# EAGLE design mycpu_monitor (EAGLE 6.5.0)
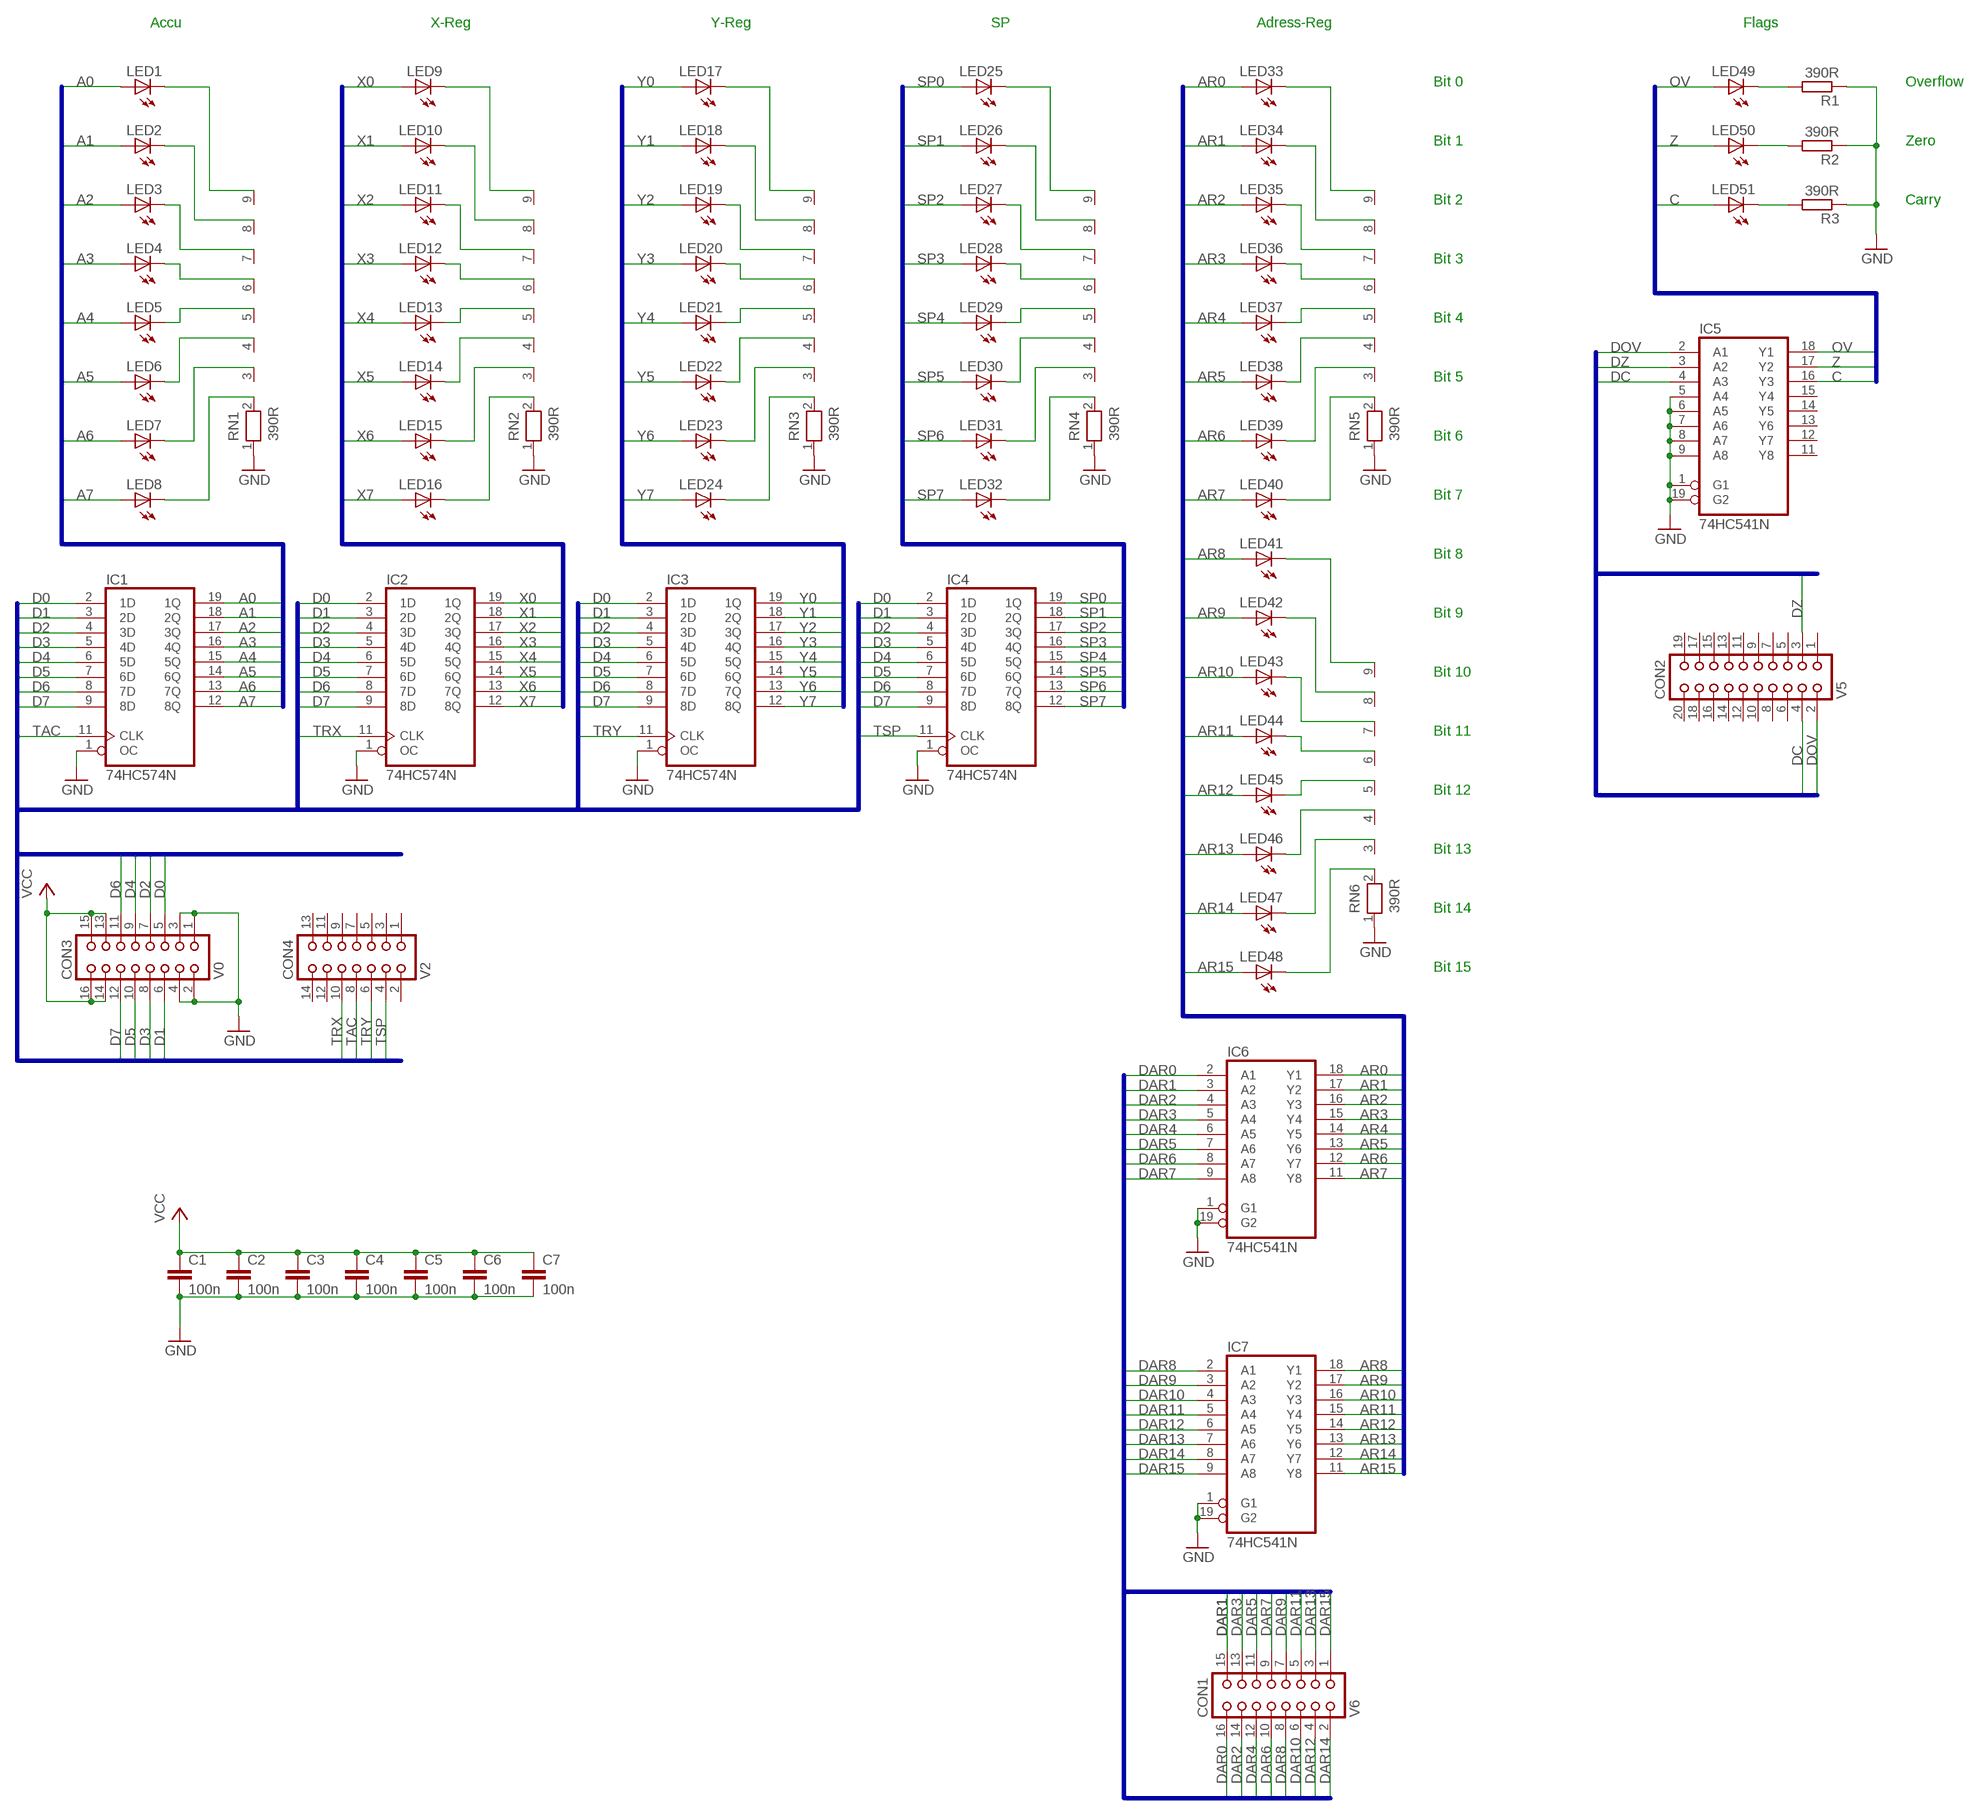
[diagram p0: schematic, sheet 1]

## Parts
C1  100n  C-EU050-024X044  [C050-024X044]
C2  100n  C-EU050-024X044  [C050-024X044]
C3  100n  C-EU050-024X044  [C050-024X044]
C4  100n  C-EU050-024X044  [C050-024X044]
C5  100n  C-EU050-024X044  [C050-024X044]
C6  100n  C-EU050-024X044  [C050-024X044]
C7  100n  C-EU050-024X044  [C050-024X044]
CON1  V6  CON16L  [CON16L]
CON2  V5  CON20L  [CON20L]
CON3  V0  CON16L  [CON16L]
CON4  V2  CON14L  [CON14L]
IC1  74HC574N  [DIL20]
IC2  74HC574N  [DIL20]
IC3  74HC574N  [DIL20]
IC4  74HC574N  [DIL20]
IC5  74HC541N  [DIL20]
IC6  74HC541N  [DIL20]
IC7  74HC541N  [DIL20]
LED1  LED3MM  [LED3MM]
LED2  LED3MM  [LED3MM]
LED3  LED3MM  [LED3MM]
LED4  LED3MM  [LED3MM]
LED5  LED3MM  [LED3MM]
LED6  LED3MM  [LED3MM]
LED7  LED3MM  [LED3MM]
LED8  LED3MM  [LED3MM]
LED9  LED3MM  [LED3MM]
LED10  LED3MM  [LED3MM]
LED11  LED3MM  [LED3MM]
LED12  LED3MM  [LED3MM]
LED13  LED3MM  [LED3MM]
LED14  LED3MM  [LED3MM]
LED15  LED3MM  [LED3MM]
LED16  LED3MM  [LED3MM]
LED17  LED3MM  [LED3MM]
LED18  LED3MM  [LED3MM]
LED19  LED3MM  [LED3MM]
LED20  LED3MM  [LED3MM]
LED21  LED3MM  [LED3MM]
LED22  LED3MM  [LED3MM]
LED23  LED3MM  [LED3MM]
LED24  LED3MM  [LED3MM]
LED25  LED3MM  [LED3MM]
LED26  LED3MM  [LED3MM]
LED27  LED3MM  [LED3MM]
LED28  LED3MM  [LED3MM]
LED29  LED3MM  [LED3MM]
LED30  LED3MM  [LED3MM]
LED31  LED3MM  [LED3MM]
LED32  LED3MM  [LED3MM]
LED33  LED3MM  [LED3MM]
LED34  LED3MM  [LED3MM]
LED35  LED3MM  [LED3MM]
LED36  LED3MM  [LED3MM]
LED37  LED3MM  [LED3MM]
LED38  LED3MM  [LED3MM]
LED39  LED3MM  [LED3MM]
LED40  LED3MM  [LED3MM]
LED41  LED3MM  [LED3MM]
LED42  LED3MM  [LED3MM]
LED43  LED3MM  [LED3MM]
LED44  LED3MM  [LED3MM]
LED45  LED3MM  [LED3MM]
LED46  LED3MM  [LED3MM]
LED47  LED3MM  [LED3MM]
LED48  LED3MM  [LED3MM]
LED49  LED3MM  [LED3MM]
LED50  LED3MM  [LED3MM]
LED51  LED3MM  [LED3MM]
R1  390R  R-EU_0207/7  [0207/7]
R2  390R  R-EU_0207/7  [0207/7]
R3  390R  R-EU_0207/7  [0207/7]
RN1  390R  RN08  [RN-9]
RN2  390R  RN08  [RN-9]
RN3  390R  RN08  [RN-9]
RN4  390R  RN08  [RN-9]
RN5  390R  RN08  [RN-9]
RN6  390R  RN08  [RN-9]

## Nets
A0: IC1.19(1Q) LED1.A
A1: IC1.18(2Q) LED2.A
A2: IC1.17(3Q) LED3.A
A3: IC1.16(4Q) LED4.A
A4: IC1.15(5Q) LED5.A
A5: IC1.14(6Q) LED6.A
A6: IC1.13(7Q) LED7.A
A7: IC1.12(8Q) LED8.A
AR0: IC6.18(Y1) LED33.A
AR1: IC6.17(Y2) LED34.A
AR2: IC6.16(Y3) LED35.A
AR3: IC6.15(Y4) LED36.A
AR4: IC6.14(Y5) LED37.A
AR5: IC6.13(Y6) LED38.A
AR6: IC6.12(Y7) LED39.A
AR7: IC6.11(Y8) LED40.A
AR8: IC7.18(Y1) LED41.A
AR9: IC7.17(Y2) LED42.A
AR10: IC7.16(Y3) LED43.A
AR11: IC7.15(Y4) LED44.A
AR12: IC7.14(Y5) LED45.A
AR13: IC7.13(Y6) LED46.A
AR14: IC7.12(Y7) LED47.A
AR15: IC7.11(Y8) LED48.A
C: IC5.16(Y3) LED51.A
D0: CON3.5 IC1.2(1D) IC2.2(1D) IC3.2(1D) IC4.2(1D)
D1: CON3.6 IC1.3(2D) IC2.3(2D) IC3.3(2D) IC4.3(2D)
D2: CON3.7 IC1.4(3D) IC2.4(3D) IC3.4(3D) IC4.4(3D)
D3: CON3.8 IC1.5(4D) IC2.5(4D) IC3.5(4D) IC4.5(4D)
D4: CON3.9 IC1.6(5D) IC2.6(5D) IC3.6(5D) IC4.6(5D)
D5: CON3.10 IC1.7(6D) IC2.7(6D) IC3.7(6D) IC4.7(6D)
D6: CON3.11 IC1.8(7D) IC2.8(7D) IC3.8(7D) IC4.8(7D)
D7: CON3.12 IC1.9(8D) IC2.9(8D) IC3.9(8D) IC4.9(8D)
DAR0: CON1.16 IC6.2(A1)
DAR1: CON1.15 IC6.3(A2)
DAR2: CON1.14 IC6.4(A3)
DAR3: CON1.13 IC6.5(A4)
DAR4: CON1.12 IC6.6(A5)
DAR5: CON1.11 IC6.7(A6)
DAR6: CON1.10 IC6.8(A7)
DAR7: CON1.9 IC6.9(A8)
DAR8: CON1.8 IC7.2(A1)
DAR9: CON1.7 IC7.3(A2)
DAR10: CON1.6 IC7.4(A3)
DAR11: CON1.5 IC7.5(A4)
DAR12: CON1.4 IC7.6(A5)
DAR13: CON1.3 IC7.7(A6)
DAR14: CON1.2 IC7.8(A7)
DAR15: CON1.1 IC7.9(A8)
DC: CON2.4 IC5.4(A3)
DOV: CON2.2 IC5.2(A1)
DZ: CON2.3 IC5.3(A2)
GND: C1.2 C2.2 C3.2 C4.2 C5.2 C6.2 C7.2 CON3.1 CON3.2 CON3.3 CON3.4 IC1.1(OC) IC2.1(OC) IC3.1(OC) IC4.1(OC) IC5.1(G1) IC5.5(A4) IC5.6(A5) IC5.7(A6) IC5.8(A7) IC5.9(A8) IC5.19(G2) IC6.1(G1) IC6.19(G2) IC7.1(G1) IC7.19(G2) R1.1 R2.1 R3.1 RN1.1 RN2.1 RN3.1 RN4.1 RN5.1 RN6.1
N$1: LED8.K(C) RN1.2
N$2: LED7.K(C) RN1.3
N$3: LED6.K(C) RN1.4
N$4: LED5.K(C) RN1.5
N$5: LED4.K(C) RN1.6
N$6: LED3.K(C) RN1.7
N$7: LED2.K(C) RN1.8
N$8: LED1.K(C) RN1.9
N$9: LED16.K(C) RN2.2
N$10: LED15.K(C) RN2.3
N$11: LED14.K(C) RN2.4
N$12: LED13.K(C) RN2.5
N$13: LED12.K(C) RN2.6
N$14: LED11.K(C) RN2.7
N$15: LED10.K(C) RN2.8
N$16: LED9.K(C) RN2.9
N$17: LED24.K(C) RN3.2
N$18: LED23.K(C) RN3.3
N$19: LED22.K(C) RN3.4
N$20: LED21.K(C) RN3.5
N$21: LED20.K(C) RN3.6
N$22: LED19.K(C) RN3.7
N$23: LED18.K(C) RN3.8
N$24: LED17.K(C) RN3.9
N$25: LED32.K(C) RN4.2
N$26: LED31.K(C) RN4.3
N$27: LED30.K(C) RN4.4
N$28: LED29.K(C) RN4.5
N$29: LED28.K(C) RN4.6
N$30: LED27.K(C) RN4.7
N$31: LED26.K(C) RN4.8
N$32: LED25.K(C) RN4.9
N$33: LED40.K(C) RN5.2
N$34: LED39.K(C) RN5.3
N$35: LED38.K(C) RN5.4
N$36: LED37.K(C) RN5.5
N$37: LED36.K(C) RN5.6
N$38: LED35.K(C) RN5.7
N$39: LED34.K(C) RN5.8
N$40: LED33.K(C) RN5.9
N$41: LED48.K(C) RN6.2
N$42: LED47.K(C) RN6.3
N$43: LED46.K(C) RN6.4
N$44: LED45.K(C) RN6.5
N$45: LED44.K(C) RN6.6
N$46: LED43.K(C) RN6.7
N$47: LED42.K(C) RN6.8
N$48: LED41.K(C) RN6.9
N$49: LED51.K(C) R3.2
N$50: LED50.K(C) R2.2
N$51: LED49.K(C) R1.2
OV: IC5.18(Y1) LED49.A
SP0: IC4.19(1Q) LED25.A
SP1: IC4.18(2Q) LED26.A
SP2: IC4.17(3Q) LED27.A
SP3: IC4.16(4Q) LED28.A
SP4: IC4.15(5Q) LED29.A
SP5: IC4.14(6Q) LED30.A
SP6: IC4.13(7Q) LED31.A
SP7: IC4.12(8Q) LED32.A
TAC: CON4.8 IC1.11(CLK)
TRX: CON4.10 IC2.11(CLK)
TRY: CON4.6 IC3.11(CLK)
TSP: CON4.4 IC4.11(CLK)
VCC: C1.1 C2.1 C3.1 C4.1 C5.1 C6.1 C7.1 CON3.13 CON3.14 CON3.15 CON3.16
X0: IC2.19(1Q) LED9.A
X1: IC2.18(2Q) LED10.A
X2: IC2.17(3Q) LED11.A
X3: IC2.16(4Q) LED12.A
X4: IC2.15(5Q) LED13.A
X5: IC2.14(6Q) LED14.A
X6: IC2.13(7Q) LED15.A
X7: IC2.12(8Q) LED16.A
Y0: IC3.19(1Q) LED17.A
Y1: IC3.18(2Q) LED18.A
Y2: IC3.17(3Q) LED19.A
Y3: IC3.16(4Q) LED20.A
Y4: IC3.15(5Q) LED21.A
Y5: IC3.14(6Q) LED22.A
Y6: IC3.13(7Q) LED23.A
Y7: IC3.12(8Q) LED24.A
Z: IC5.17(Y2) LED50.A
Unconnected: CON2.1 CON2.5 CON2.6 CON2.7 CON2.8 CON2.9 CON2.10 CON2.11 CON2.12 CON2.13 CON2.14 CON2.15 CON2.16 CON2.17 CON2.18 CON2.19 CON2.20 CON4.1 CON4.2 CON4.3 CON4.5 CON4.7 CON4.9 CON4.11 CON4.12 CON4.13 CON4.14 IC5.11(Y8) IC5.12(Y7) IC5.13(Y6) IC5.14(Y5) IC5.15(Y4)

## Buses
AR[0..15]
DAR[0..15]
OV,Z,C
DOV,DZ,DC
SP[0..7]
Y[0..7]
X[0..7]
A[0..7]
TRX,TRY,TAC,TSP,D[0..7]

## Notes on the sheet
- Accu | X-Reg | Y-Reg | SP | Adress-Reg | Flags
- Bit 0 | Overflow
- Bit 1 | Zero
- Bit 2 | Carry
- Bit 3
- Bit 4
- Bit 5
- Bit 6
- Bit 7
- Bit 8
- Bit 9
- Bit 10
- Bit 11
- Bit 12
- Bit 13
- Bit 14
- Bit 15

## Power pins joined to a net without a drawn wire
GND: IC1.10(GND) IC2.10(GND) IC3.10(GND) IC4.10(GND) IC5.10(GND) IC6.10(GND) IC7.10(GND)
VCC: IC1.20(VCC) IC2.20(VCC) IC3.20(VCC) IC4.20(VCC) IC5.20(VCC) IC6.20(VCC) IC7.20(VCC)

## Library data of the parts
C1-C7 = rcl:C-EU: CAPACITOR, European symbol
CON1 CON3 = con-harting:CON16L: CONNECTOR; OC_FARNELL: unknown; OC_NEWARK: unknown
CON2 = con-harting:CON20L: CONNECTOR; OC_FARNELL: unknown; OC_NEWARK: unknown
CON4 = con-harting:CON14L: CONNECTOR; OC_FARNELL: unknown; OC_NEWARK: unknown
IC1-IC4 = 74xx-eu:74*574: 8-bit D type FLIP FLOP bus driver
IC5-IC7 = 74xx-eu:74*541: Octal BUFFER and LINE DRIVER, 3-state
LED1-LED51 = led:LED: LED OSRAM: - CHIPLED LG R971, LG N971, LY N971, LG Q971, LY Q971, LO R971, LY R971 LH N974, LH R974 LS Q976, LO Q976, LY Q976 LO Q996 - Hyper CHIPLED LW Q18S LB Q993, LB Q99A, LB R99A - SideLED LS A670, LO A670, LY A670, LG A670, LP A670 LB A673, LV A673, LT A673, LW A673 LH A674 LY A675 LS A676, LA A676, LO A676, LY A676, LW A676 LS A679, LY A679, LG A679 - Hyper Micro SIDELED® LS Y876, LA Y876, LO Y876, LY Y876 LT Y87S - SmartLED LW L88C, LW L88S LB L89C, LB L89S, LG L890 LS L89K, LO L89K, LY L89K LS L896, LA L896, LO L896, LY L896 - TOPLED LS T670, LO T670, LY T670, LG T670, LP T670 LSG T670, LSP T670, LSY T670, LOP T670, LYG T670 LG T671, LOG T671, LSG T671 LB T673, LV T673, LT T673, LW T673 LH T674 LS T676, LA T676, LO T676, LY T676, LB T676, LH T676, LSB T676, LW T676 LB T67C, LV T67C, LT T67C, LS T67K, LO T67K, LY T67K, LW E67C LS E67B, LA E67B, LO E67B, LY E67B, LB E67C, LV E67C, LT E67C LW T67C LS T679, LY T679, LG T679 LS T770, LO T770, LY T770, LG T770, LP T770 LB T773, LV T773, LT T773, LW T773 LH T774 LS E675, LA E675, LY E675, LS T675 LS T776, LA T776, LO T776, LY T776, LB T776 LHGB T686 LT T68C, LB T68C - Hyper Mini TOPLED® LB M676 - Mini TOPLED Santana® LG M470 LS M47K, LO M47K, LY M47K Source: http://www.osram.convergy.de LUXEON: - LUMILED® LXK2-PW12-R00, LXK2-PW12-S00, LXK2-PW14-U00, LXK2-PW14-V00 LXK2-PM12-R00, LXK2-PM12-S00, LXK2-PM14-U00 LXK2-PE12-Q00, LXK2-PE12-R00, LXK2-PE12-S00, LXK2-PE14-T00, LXK2-PE14-U00 LXK2-PB12-K00, LXK2-PB12-L00, LXK2-PB12-M00, LXK2-PB14-N00, LXK2-PB14-P00, LXK2-PB14-Q00 LXK2-PR12-L00, LXK2-PR12-M00, LXK2-PR14-Q00, LXK2-PR14-R00 LXK2-PD12-Q00, LXK2-PD12-R00, LXK2-PD12-S00 LXK2-PH12-R00, LXK2-PH12-S00 LXK2-PL12-P00, LXK2-PL12-Q00, LXK2-PL12-R00 Source: www.luxeon.com KINGBRIGHT: KA-3528ASYC Source: www.kingbright.com
R1-R3 = resistor:R-EU_: RESISTOR, European symbol
RN1-RN6 = resistor-net:RN08: RESISTOR NETWORK; OC_FARNELL: unknown; OC_NEWARK: unknown

## Board
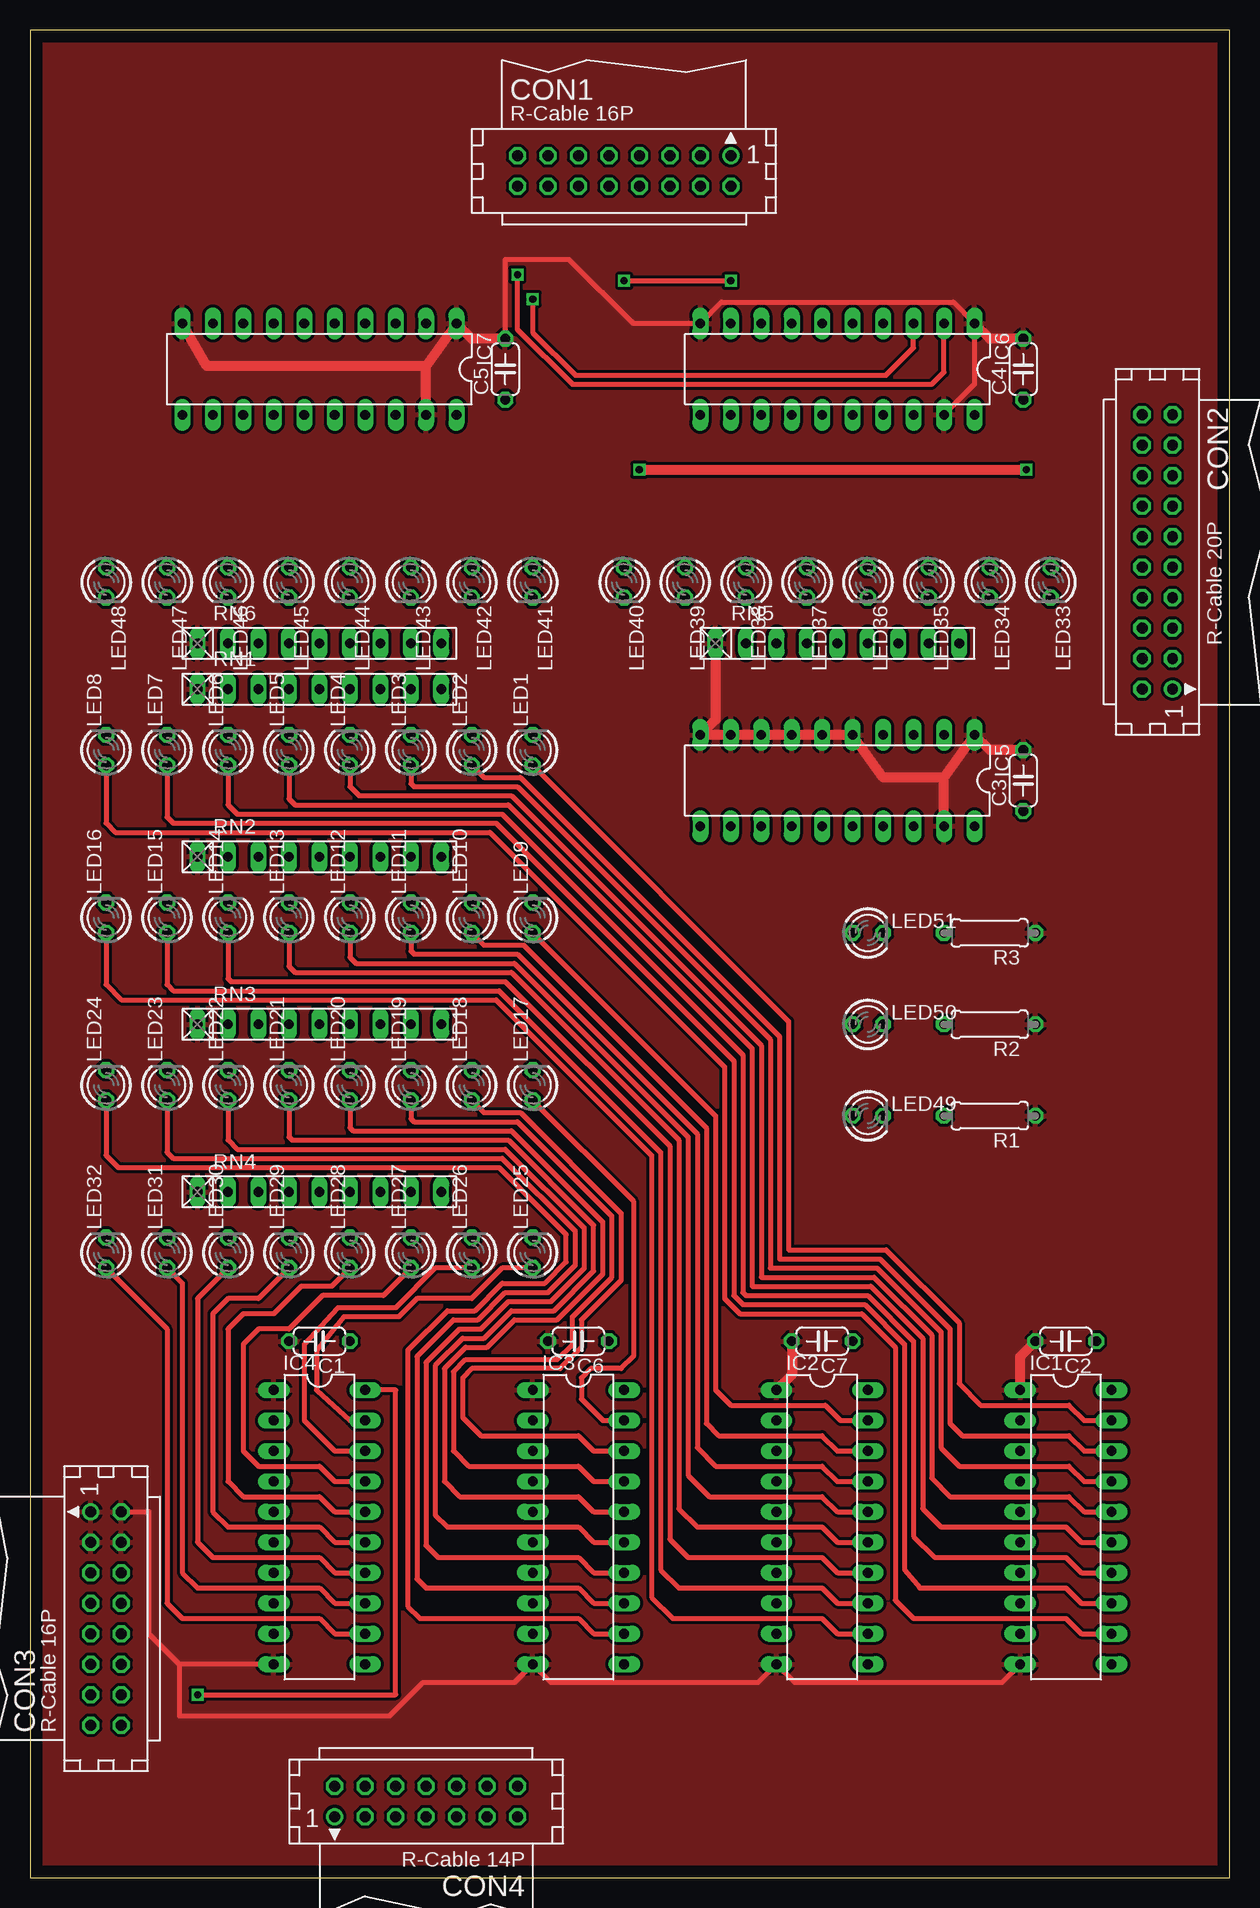
[diagram p1: board, top side]
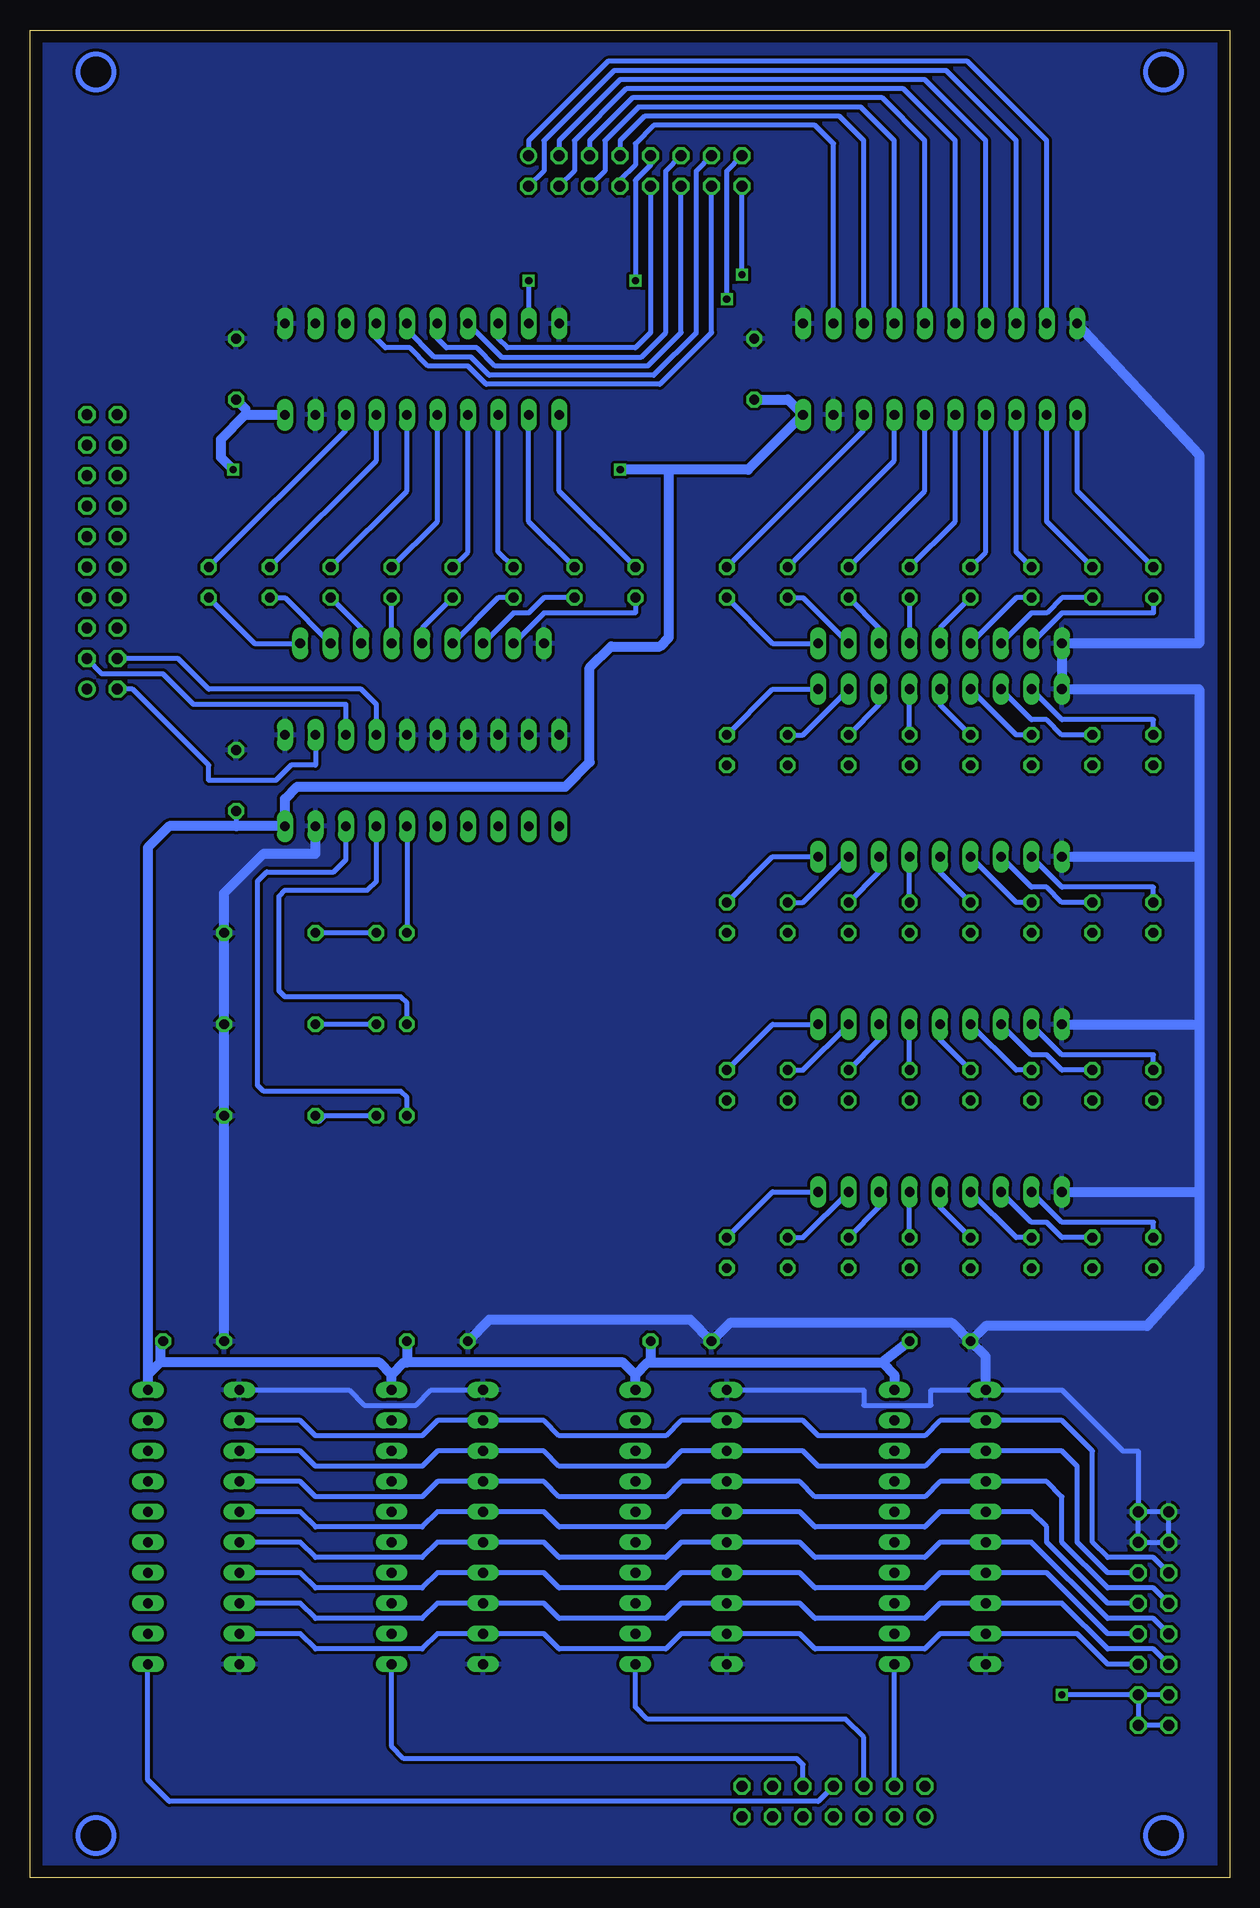
[diagram p2: board, bottom side, seen from below]

Size 100 x 154 mm. Coordinates in mm from the lower left corner, seen from the top.
Outline: 0,0 100,0 100,154 0,154 0,0
Copper layers (1*16): Top 0.035mm / dielectric 1.5mm / Bottom 0.035mm
Design rules "default": minimum track width 10mil, minimum drill 24mil, track to track 10mil, track to pad 20mil, pad to pad 8mil, via to via 8mil, smd to smd 8mil, copper to edge 40mil, drill to drill 8mil, minimum pad ring 10mil, minimum via ring 8mil, stop-mask expansion 4mil, vias tented up to drill 0mil, thermal gap 10mil

### Footprints (pad centres in the part's own frame; a part is rotated, then mirrored left to right if it is on the bottom)
C050-024X044 = drill 0.813 octagon: 1 -2.54,0; 2 2.54,0
CON16L = drill 0.914: 1 8.89,1.27 | drill 0.914 octagon: 2 8.89,-1.27; 3 6.35,1.27; 4 6.35,-1.27; 5 3.81,1.27; 6 3.81,-1.27; 7 1.27,1.27; 8 1.27,-1.27; 9 -1.27,1.27; 10 -1.27,-1.27; 11 -3.81,1.27; 12 -3.81,-1.27; 13 -6.35,1.27; 14 -6.35,-1.27; 15 -8.89,1.27; 16 -8.89,-1.27
CON20L = drill 0.914: 1 11.43,1.27 | drill 0.914 octagon: 2 11.43,-1.27; 3 8.89,1.27; 4 8.89,-1.27; 5 6.35,1.27; 6 6.35,-1.27; 7 3.81,1.27; 8 3.81,-1.27; 9 1.27,1.27; 10 1.27,-1.27; 11 -1.27,1.27; 12 -1.27,-1.27; 13 -3.81,1.27; 14 -3.81,-1.27; 15 -6.35,1.27; 16 -6.35,-1.27; 17 -8.89,1.27; 18 -8.89,-1.27; 19 -11.43,1.27; 20 -11.43,-1.27
CON14L = drill 0.914: 1 7.62,1.27 | drill 0.914 octagon: 2 7.62,-1.27; 3 5.08,1.27; 4 5.08,-1.27; 5 2.54,1.27; 6 2.54,-1.27; 7 0,1.27; 8 0,-1.27; 9 -2.54,1.27; 10 -2.54,-1.27; 11 -5.08,1.27; 12 -5.08,-1.27; 13 -7.62,1.27; 14 -7.62,-1.27
DIL20 = drill 0.813 long: 1 -11.43,-3.81; 2 -8.89,-3.81; 3 -6.35,-3.81; 4 -3.81,-3.81; 5 -1.27,-3.81; 6 1.27,-3.81; 7 3.81,-3.81; 8 6.35,-3.81; 9 8.89,-3.81; 10 11.43,-3.81; 11 11.43,3.81; 12 8.89,3.81; 13 6.35,3.81; 14 3.81,3.81; 15 1.27,3.81; 16 -1.27,3.81; 17 -3.81,3.81; 18 -6.35,3.81; 19 -8.89,3.81; 20 -11.43,3.81
LED3MM = drill 0.813 octagon: A -1.27,0; K 1.27,0
0207/7 = drill 0.813 octagon: 1 -3.81,0; 2 3.81,0
RN-9 = drill 0.813 long: 1 -10.16,0; 2 -7.62,0; 3 -5.08,0; 4 -2.54,0; 5 0,0; 6 2.54,0; 7 5.08,0; 8 7.62,0; 9 10.16,0

### Placement (x,y rotation side)
C1  24.13,44.7 180 top
C2  86.36,44.7 180 top
C3  82.8,91.44 90 top
C4  82.8,125.73 90 top
C5  39.62,125.73 90 top
C6  45.72,44.7 180 top
C7  66.04,44.7 180 top
CON1  49.53,142.24 0 top
CON2  93.98,110.49 270 top
CON3  6.35,21.59 90 top
CON4  33.02,6.35 180 top
IC1  86.36,29.21 270 top
IC2  66.04,29.21 270 top
IC3  45.72,29.21 270 top
IC4  24.13,29.21 270 top
IC5  67.31,91.44 180 top
IC6  67.31,125.73 180 top
IC7  24.13,125.73 180 top
LED1  41.91,93.98 90 top
LED2  36.83,93.98 90 top
LED3  31.75,93.98 90 top
LED4  26.67,93.98 90 top
LED5  21.59,93.98 90 top
LED6  16.51,93.98 90 top
LED7  11.43,93.98 90 top
LED8  6.35,93.98 90 top
LED9  41.91,80.01 90 top
LED10  36.83,80.01 90 top
LED11  31.75,80.01 90 top
LED12  26.67,80.01 90 top
LED13  21.59,80.01 90 top
LED14  16.51,80.01 90 top
LED15  11.43,80.01 90 top
LED16  6.35,80.01 90 top
LED17  41.91,66.04 90 top
LED18  36.83,66.04 90 top
LED19  31.75,66.04 90 top
LED20  26.67,66.04 90 top
LED21  21.59,66.04 90 top
LED22  16.51,66.04 90 top
LED23  11.43,66.04 90 top
LED24  6.35,66.04 90 top
LED25  41.91,52.07 90 top
LED26  36.83,52.07 90 top
LED27  31.75,52.07 90 top
LED28  26.67,52.07 90 top
LED29  21.59,52.07 90 top
LED30  16.51,52.07 90 top
LED31  11.43,52.07 90 top
LED32  6.35,52.07 90 top
LED33  85.09,107.95 270 top
LED34  80.01,107.95 270 top
LED35  74.93,107.95 270 top
LED36  69.85,107.95 270 top
LED37  64.77,107.95 270 top
LED38  59.69,107.95 270 top
LED39  54.61,107.95 270 top
LED40  49.53,107.95 270 top
LED41  41.91,107.95 270 top
LED42  36.83,107.95 270 top
LED43  31.75,107.95 270 top
LED44  26.67,107.95 270 top
LED45  21.59,107.95 270 top
LED46  16.51,107.95 270 top
LED47  11.43,107.95 270 top
LED48  6.35,107.95 270 top
LED49  69.85,63.5 0 top
LED50  69.85,71.12 0 top
LED51  69.85,78.74 0 top
R1  80.01,63.5 180 top
R2  80.01,71.12 180 top
R3  80.01,78.74 180 top
RN1  24.13,99.06 0 top
RN2  24.13,85.09 0 top
RN3  24.13,71.12 0 top
RN4  24.13,57.15 0 top
RN5  67.31,102.87 0 top
RN6  24.13,102.87 0 top

### Tracks (layer width: path | path; a pad name or v marks a point on that pad's centre or on a via)
A0
  Top 0.406: LED1.A 63.25,71.37 63.25,52.32 71.37,52.32 77.47,46.23 77.47,41.15 79.25,39.37 86.61,39.37 87.88,38.1 IC1.19
A1
  Top 0.406: LED2.A 37.85,91.69 40.89,91.69 62.48,70.1 62.48,51.56 70.87,51.56 76.71,45.72 76.71,37.85 77.72,36.83 86.61,36.83 87.88,35.56 IC1.18
A2
  Top 0.406: LED3.A 31.75,91.19 32,90.93 40.64,90.93 61.72,69.85 61.72,50.8 70.61,50.8 75.95,45.47 75.95,35.81 77.47,34.29 86.61,34.29 87.88,33.02 IC1.17
A3
  Top 0.254: 90.42,30.48 IC1.16
  Top 0.406: LED4.A 26.67,90.93 27.43,90.17 40.13,90.17 60.96,69.34 60.96,50.04 70.36,50.04 75.18,45.21 75.18,33.27 76.71,31.75 86.61,31.75 87.88,30.48 IC1.16
A4
  Top 0.406: LED5.A 21.59,89.92 22.1,89.41 39.88,89.41 60.2,69.09 60.2,49.28 70.1,49.28 74.42,44.96 74.42,30.73 75.95,29.21 86.36,29.21 87.63,27.94 IC1.15
A5
  Top 0.406: LED6.A 16.51,89.41 17.27,88.65 39.37,88.65 59.44,68.58 59.44,48.77 59.69,48.51 69.85,48.51 73.66,44.7 73.66,28.45 75.44,26.67 86.36,26.67 87.63,25.4 IC1.14
A6
  Top 0.406: LED7.A 11.43,88.39 11.94,87.88 38.86,87.88 58.67,68.07 58.67,48.51 59.44,47.75 69.6,47.75 72.9,44.45 72.9,25.65 74.17,24.13 86.36,24.13 87.63,22.86 IC1.13
A7
  Top 0.406: LED8.A 6.35,87.88 7.11,87.12 38.35,87.12 57.91,67.56 57.91,48.26 59.18,46.99 69.34,46.99 72.14,44.2 72.14,23.11 73.66,21.59 86.36,21.59 87.63,20.32 IC1.12
AR0
  Bottom 0.406: LED33.A 73.66,120.65 IC6.18
AR1
  Bottom 0.406: LED34.A 71.12,118.11 IC6.17
AR2
  Bottom 0.406: LED35.A 68.58,115.57 IC6.16
AR3
  Bottom 0.406: LED36.A 66.04,113.03 IC6.15
AR4
  Bottom 0.406: LED37.A 63.5,110.49 IC6.14
AR5
  Bottom 0.406: LED38.A 60.96,110.49 IC6.13
AR6
  Bottom 0.406: LED39.A 58.42,113.03 IC6.12
AR7
  Bottom 0.406: LED40.A 55.88,115.57 IC6.11
AR8
  Bottom 0.406: LED41.A 30.48,120.65 IC7.18
AR9
  Bottom 0.406: LED42.A 27.94,118.11 IC7.17
AR10
  Bottom 0.406: LED43.A 25.4,115.57 IC7.16
AR11
  Bottom 0.406: LED44.A 22.86,113.03 IC7.15
AR12
  Bottom 0.406: LED45.A 20.32,110.49 IC7.14
AR13
  Bottom 0.406: LED46.A 17.78,110.49 IC7.13
AR14
  Bottom 0.406: LED47.A 15.24,113.03 IC7.12
AR15
  Bottom 0.406: LED48.A 12.7,115.57 IC7.11
C
  Bottom 0.406: IC5.16 LED51.A
D0
  Bottom 0.406: CON3.5 6.35,26.67 10.16,26.67 11.43,27.94 11.43,35.56 13.97,38.1 IC4.2 24.13,38.1 25.4,36.83 34.29,36.83 35.56,38.1 IC3.2 45.72,38.1 46.99,36.83 55.88,36.83 57.15,38.1 IC2.2 66.04,38.1 67.31,36.83 76.2,36.83 77.47,38.1 IC1.2
D1
  Bottom 0.406: CON3.6 10.16,25.4 12.7,27.94 12.7,34.29 13.97,35.56 IC4.3 24.13,35.56 25.4,34.29 34.29,34.29 35.56,35.56 IC3.3 45.72,35.56 46.99,34.29 55.88,34.29 57.15,35.56 IC2.3 66.04,35.56 67.31,34.29 76.2,34.29 77.47,35.56 IC1.3
D2
  Bottom 0.406: CON3.7 6.35,24.13 10.16,24.13 13.97,27.94 13.97,31.75 15.24,33.02 IC4.4 24.13,33.02 25.4,31.75 34.54,31.75 35.81,33.02 IC3.4 45.72,33.02 46.99,31.75 55.88,31.75 57.15,33.02 IC2.4 66.04,33.02 67.31,31.75 76.2,31.75 77.47,33.02 IC1.4
D3
  Bottom 0.406: CON3.8 10.16,22.86 15.24,27.94 15.24,29.21 16.51,30.48 IC4.5 24.13,30.48 25.4,29.21 34.54,29.21 35.81,30.48 IC3.5 45.72,30.48 46.99,29.21 55.88,29.21 57.15,30.48 IC2.5 66.04,30.48 67.31,29.21 76.2,29.21 77.47,30.48 IC1.5
D4
  Bottom 0.406: CON3.9 6.35,21.59 10.16,21.59 16.51,27.94 IC4.6 24.13,27.94 25.4,26.67 34.54,26.67 35.81,27.94 IC3.6 45.72,27.94 46.99,26.67 55.88,26.67 57.15,27.94 IC2.6 66.04,27.94 67.31,26.67 76.2,26.67 77.47,27.94 IC1.6
D5
  Bottom 0.406: CON3.10 10.16,20.32 15.24,25.4 IC4.7 24.13,25.4 25.4,24.13 34.54,24.13 35.81,25.4 IC3.7 45.72,25.4 46.99,24.13 55.88,24.13 57.15,25.4 IC2.7 66.04,25.4 67.31,24.13 76.2,24.13 77.47,25.4 IC1.7
D6
  Bottom 0.406: CON3.11 6.35,19.05 10.16,19.05 13.97,22.86 IC4.8 24.13,22.86 25.4,21.59 34.54,21.59 35.81,22.86 IC3.8 45.72,22.86 46.99,21.59 55.88,21.59 57.15,22.86 IC2.8 66.04,22.86 67.31,21.59 76.2,21.59 77.47,22.86 IC1.8
D7
  Bottom 0.406: CON3.12 10.16,17.78 12.7,20.32 IC4.9 24.13,20.32 25.4,19.05 34.54,19.05 35.81,20.32 IC3.9 45.72,20.32 46.99,19.05 55.88,19.05 57.15,20.32 IC2.9 66.04,20.32 67.31,19.05 76.2,19.05 77.47,20.32 IC1.9
DAR0  (via drill 0.6)
  Top 0.406: IC6.2 76.2,125.48 75.18,124.46 45.21,124.46 40.64,129.03 v40.64,133.6
  Bottom 0.406: v40.64,133.6 CON1.16
DAR1  (via drill 0.6)
  Top 0.406: v41.91,131.57 41.91,128.78 45.47,125.22 71.37,125.22 73.66,127.51 IC6.3
  Bottom 0.406: v41.91,131.57 41.91,142.24 CON1.15
DAR2
  Bottom 0.406: CON1.14 43.18,128.78 47.5,124.46 61.98,124.46 63.5,125.98 66.8,125.98 68.33,127.51 70.36,127.51 71.12,128.27 IC6.4
DAR3
  Bottom 0.406: CON1.13 44.45,142.24 44.45,128.78 48.01,125.22 61.72,125.22 63.25,126.75 66.29,126.75 68.58,129.03 IC6.5
DAR4
  Bottom 0.406: CON1.12 45.72,128.78 48.51,125.98 61.21,125.98 62.74,127.51 65.28,127.51 66.04,128.27 IC6.6
DAR5
  Bottom 0.406: CON1.11 46.99,142.24 46.99,128.78 49.02,126.75 60.71,126.75 IC6.7
DAR6
  Bottom 0.406: CON1.10 48.26,128.78 49.53,127.51 60.2,127.51 60.96,128.27 IC6.8
DAR7  (via drill 0.6)
  Top 0.406: v49.53,133.1 v58.42,133.1
  Bottom 0.406: CON1.9 48.26,142.75 49.53,141.48 v49.53,133.1 | v58.42,133.1 IC6.9
DAR8
  Bottom 0.406: IC7.2 33.02,144.53 34.54,146.05 48.01,146.05 49.53,144.53 49.53,142.75 50.8,141.48 CON1.8
DAR9
  Bottom 0.406: IC7.3 30.48,144.78 32.51,146.81 48.77,146.81 50.8,144.78 CON1.7
DAR10
  Bottom 0.406: IC7.4 27.94,144.78 30.73,147.57 49.28,147.57 52.07,144.78 52.07,142.24 CON1.6
DAR11
  Bottom 0.406: IC7.5 25.4,144.78 28.96,148.34 49.78,148.34 53.34,144.78 CON1.5
DAR12
  Bottom 0.406: IC7.6 22.86,144.78 27.18,149.1 50.29,149.1 54.61,144.78 54.61,142.24 CON1.4
DAR13
  Bottom 0.406: IC7.7 20.32,144.78 25.4,149.86 50.8,149.86 55.88,144.78 CON1.3
DAR14
  Bottom 0.406: IC7.8 17.78,144.78 23.62,150.62 51.31,150.62 57.15,144.78 57.15,142.24 CON1.2
DAR15
  Bottom 0.406: IC7.9 15.24,144.78 21.84,151.38 51.82,151.38 58.42,144.78 CON1.1
DC
  Bottom 0.406: IC5.4 71.12,97.79 72.39,99.06 85.09,99.06 87.63,101.6 CON2.4
DOV
  Bottom 0.406: IC5.2 76.2,92.71 78.23,92.71 79.5,91.44 85.09,91.44 85.09,92.71 91.44,99.06 CON2.2
DZ
  Bottom 0.406: IC5.3 73.66,97.79 86.36,97.79 88.9,100.33 93.98,100.33 CON2.3
GND
  Top 0.406: CON3.2 9.91,30.48 9.91,20.32 12.45,17.78 | IC4.10 12.45,17.78 | 12.45,17.78 12.45,13.46 29.97,13.46 32.77,16.26 40.39,16.26 IC3.10 43.43,16.26 60.71,16.26 IC2.10 63.75,16.26 81.03,16.26 IC1.10 | IC6.19 78.74,124.46 IC6.1 76.96,131.32 57.66,131.32 IC6.10 50.29,129.54 44.96,134.87 39.62,134.87 C5.2
  Top 0.813: C7.2 63.5,41.91 IC2.1 | IC1.1 82.55,43.43 C2.2 | IC5.19 76.2,91.69 | C3.2 80.01,93.98 IC5.1 76.2,91.69 | 76.2,91.69 71.12,91.69 IC5.5 IC5.6 IC5.7 IC5.8 IC5.9 IC5.10 57.15,96.52 RN5.1 | C4.2 80.01,128.27 IC6.1 | C5.2 36.83,128.27 IC7.1 33.02,125.98 | IC7.19 33.02,125.98 | 33.02,125.98 14.73,125.98 IC7.10
  Bottom 0.406: IC3.1 30.48,40.64 30.48,39.37 24.89,39.37 24.89,40.64 IC4.1 13.97,40.64 8.89,35.56 7.62,35.56 CON3.2 | CON3.2 CON3.1 CON3.3 CON3.4 CON3.2 | IC1.1 73.41,40.64 72.14,39.37 67.82,39.37 66.55,40.64 IC2.1
  Bottom 0.813: IC4.1 20.32,43.43 C1.2 | C1.2 23.11,46.23 41.66,46.23 C6.2 44.96,46.48 61.72,46.48 C7.2 | C2.2 R1.1 R2.1 R3.1 83.82,82.04 80.52,85.34 76.2,85.34 IC5.19 | IC7.10 2.54,118.62 2.54,102.87 RN6.1 RN1.1 2.54,99.06 2.54,85.09 | RN2.1 2.54,85.09 | 2.54,85.09 2.54,71.12 | RN3.1 2.54,71.12 | 2.54,71.12 2.54,57.15 | RN4.1 2.54,57.15 | 2.54,57.15 2.54,50.8 6.86,45.97 20.32,45.97 C1.2
  pour Bottom: 0,154 100,154 100,0 0,0
  pour Top: 0,0 0,154 100.08,154 100.08,0
N$1
  Bottom 0.406: LED8.K 6.35,96.52 13.97,96.52 RN1.2
N$2
  Bottom 0.406: LED7.K 13.97,95.25 15.24,96.52 16.51,96.52 RN1.3
N$3
  Bottom 0.406: LED6.K 17.78,95.25 RN1.4
N$4
  Bottom 0.406: LED5.K 24.13,97.79 RN1.5
N$5
  Bottom 0.406: LED4.K RN1.6
N$6
  Bottom 0.406: LED3.K 29.21,97.79 RN1.7
N$7
  Bottom 0.406: LED2.K 35.56,95.25 RN1.8
N$8
  Bottom 0.406: LED1.K 38.1,99.06 RN1.9
N$9
  Bottom 0.406: LED16.K 6.35,82.55 13.97,82.55 RN2.2
N$10
  Bottom 0.406: LED15.K 13.97,81.28 15.24,82.55 16.51,82.55 RN2.3
N$11
  Bottom 0.406: LED14.K 17.78,81.28 RN2.4
N$12
  Bottom 0.406: LED13.K 24.13,83.82 RN2.5
N$13
  Bottom 0.406: LED12.K RN2.6
N$14
  Bottom 0.406: LED11.K 29.21,83.82 RN2.7
N$15
  Bottom 0.406: LED10.K 35.56,81.28 RN2.8
N$16
  Bottom 0.406: LED9.K 38.1,85.09 RN2.9
N$17
  Bottom 0.406: LED24.K 6.35,68.58 13.97,68.58 RN3.2
N$18
  Bottom 0.406: LED23.K 13.97,67.31 15.24,68.58 16.51,68.58 RN3.3
N$19
  Bottom 0.406: LED22.K 17.78,67.31 RN3.4
N$20
  Bottom 0.406: LED21.K 24.13,69.85 RN3.5
N$21
  Bottom 0.406: LED20.K RN3.6
N$22
  Bottom 0.406: LED19.K 29.21,69.85 RN3.7
N$23
  Bottom 0.406: LED18.K 35.56,67.31 RN3.8
N$24
  Bottom 0.406: LED17.K 38.1,71.12 RN3.9
N$25
  Bottom 0.406: LED32.K 6.35,54.61 13.97,54.61 RN4.2
N$26
  Bottom 0.406: LED31.K 13.97,53.34 15.24,54.61 16.51,54.61 RN4.3
N$27
  Bottom 0.406: LED30.K 17.78,53.34 RN4.4
N$28
  Bottom 0.406: LED29.K 24.13,55.88 RN4.5
N$29
  Bottom 0.406: LED28.K RN4.6
N$30
  Bottom 0.406: LED27.K 29.21,55.88 RN4.7
N$31
  Bottom 0.406: LED26.K 35.56,53.34 RN4.8
N$32
  Bottom 0.406: LED25.K 38.1,57.15 RN4.9
N$33
  Bottom 0.406: LED40.K 49.53,105.41 57.15,105.41 RN5.2
N$34
  Bottom 0.406: LED39.K 57.15,106.68 58.42,105.41 59.69,105.41 RN5.3
N$35
  Bottom 0.406: LED38.K 60.96,106.68 RN5.4
N$36
  Bottom 0.406: LED37.K 67.31,104.14 RN5.5
N$37
  Bottom 0.406: RN5.6 LED36.K
N$38
  Bottom 0.406: LED35.K 72.39,104.14 RN5.7
N$39
  Bottom 0.406: LED34.K 78.74,106.68 RN5.8
N$40
  Bottom 0.406: LED33.K 81.28,102.87 RN5.9
N$41
  Bottom 0.406: LED48.K 6.35,105.41 13.97,105.41 RN6.2
N$42
  Bottom 0.406: LED47.K 13.97,106.68 15.24,105.41 16.51,105.41 RN6.3
N$43
  Bottom 0.406: LED46.K 17.78,106.68 RN6.4
N$44
  Bottom 0.406: LED45.K 24.13,104.14 RN6.5
N$45
  Bottom 0.406: LED44.K RN6.6
N$46
  Bottom 0.406: LED43.K 29.21,104.14 RN6.7
N$47
  Bottom 0.406: LED42.K 35.56,106.68 RN6.8
N$48
  Bottom 0.406: LED41.K 38.1,102.87 RN6.9
N$49
  Bottom 0.406: LED51.K R3.2
N$50
  Bottom 0.406: LED50.K R2.2
N$51
  Bottom 0.406: LED49.K 75.44,63.5 75.95,62.99 75.95,63.25 R1.2
OV
  Bottom 0.406: LED49.A 68.58,65.02 69.09,65.53 80.52,65.53 81.03,66.04 81.03,83.06 80.26,83.82 74.68,83.82 73.66,84.84 IC5.18
SP0
  Top 0.406: LED25.A 39.37,50.8 36.83,48.26 32.26,48.26 30.73,46.74 26.16,46.74 23.88,43.94 23.88,40.64 26.67,38.1 IC4.19
SP1
  Top 0.406: LED26.A 33.78,50.8 30.48,47.5 25.65,47.5 22.86,44.45 22.86,38.1 25.4,35.56 IC4.18
SP2
  Top 0.406: LED27.A 29.46,48.51 24.38,48.51 21.59,45.72 19.05,45.72 17.78,44.45 17.78,35.56 19.05,34.29 24.13,34.29 25.4,33.02 IC4.17
SP3
  Top 0.406: LED28.A 25.15,49.28 22.61,49.28 20.32,46.99 17.78,46.99 16.51,45.72 16.51,33.02 17.78,31.75 24.13,31.75 25.4,30.48 IC4.16
SP4
  Top 0.406: LED29.A 19.05,48.26 16.51,48.26 15.24,46.99 15.24,30.48 16.51,29.21 24.13,29.21 25.4,27.94 IC4.15
SP5
  Top 0.406: LED30.A 13.97,48.26 13.97,27.94 15.24,26.67 24.13,26.67 25.4,25.4 IC4.14
SP6
  Top 0.406: LED31.A 12.7,49.53 12.7,25.4 13.97,24.13 24.13,24.13 25.4,22.86 IC4.13
SP7
  Top 0.406: LED32.A 11.43,45.72 11.43,22.86 12.7,21.59 24.13,21.59 25.4,20.32 IC4.12
TAC
  Bottom 0.406: CON4.8 34.29,6.35 88.39,6.35 90.17,8.13 IC1.11
TRX
  Bottom 0.406: CON4.10 35.56,9.4 36.07,9.91 68.83,9.91 69.85,10.92 IC2.11
TRY
  Bottom 0.406: CON4.6 30.48,11.68 32,13.21 48.51,13.21 49.53,14.22 IC3.11
TSP
  Bottom 0.406: CON4.4 IC4.11
VCC  (via drill 0.6)
  Top 0.406: v13.97,15.24 30.48,15.24 30.48,40.64 IC4.20
  Top 0.813: v50.8,117.35 v83.06,117.35
  Bottom 0.406: CON3.13 CON3.14 | CON3.15 CON3.16 CON3.14 | CON3.14 v13.97,15.24 | 46.74,117.09 46.48,117.35 | 48.51,42.93 48.26,42.93 | 68.58,42.93 68.83,42.93 | C2.1 89.15,44.7 | C3.1 82.8,87.63 | 82.04,121.92 82.04,122.43
  Bottom 0.813: v50.8,117.35 46.48,117.35 40.13,117.35 IC7.20 36.83,123.19 C5.1 | v83.06,117.35 84.07,118.36 84.07,119.89 82.04,121.92 IC6.20 | 46.74,117.09 46.74,103.38 47.5,102.62 51.56,102.62 53.34,100.84 53.34,92.96 55.37,90.93 77.72,90.93 78.74,89.92 IC5.20 82.8,87.63 88.39,87.63 90.17,85.85 90.17,41.91 | 49.53,41.91 48.51,42.93 | 28.96,42.93 48.26,42.93 C6.1 | 28.96,42.93 27.94,41.91 IC4.20 | IC3.20 49.53,41.91 | 49.53,41.91 50.55,42.93 68.58,42.93 C7.1 | 68.83,42.93 69.85,41.91 | IC2.20 69.85,41.91 | 69.85,41.91 70.87,42.93 89.15,42.93 | 89.15,42.93 90.17,41.91 | 90.17,41.91 IC1.20 | C1.1 28.96,42.93 | 89.15,44.7 89.15,42.93 | 82.04,122.43 C4.1
X0
  Top 0.406: LED9.A 57.15,63.5 57.15,40.64 58.42,39.37 66.29,39.37 67.56,38.1 IC2.19
X1
  Top 0.406: LED10.A 37.85,77.72 41.15,77.72 56.39,62.48 56.39,37.85 57.4,36.83 66.04,36.83 67.31,35.56 IC2.18
X2
  Top 0.406: LED11.A 31.75,77.22 32,76.96 40.64,76.96 55.63,61.98 55.63,35.81 57.15,34.29 66.04,34.29 67.31,33.02 IC2.17
X3
  Top 0.406: LED12.A 26.67,76.71 27.18,76.2 40.39,76.2 54.86,61.72 54.86,33.53 56.64,31.75 66.04,31.75 67.31,30.48 IC2.16
X4
  Top 0.406: LED13.A 21.59,75.95 22.1,75.44 40.13,75.44 54.1,61.47 54.1,30.73 55.63,29.21 66.04,29.21 67.31,27.94 IC2.15
X5
  Top 0.406: LED14.A 16.51,74.93 16.76,74.68 39.62,74.68 53.34,60.96 53.34,28.19 54.86,26.67 66.04,26.67 67.31,25.4 IC2.14
X6
  Top 0.406: LED15.A 11.43,74.42 11.94,73.91 39.12,73.91 52.58,60.45 52.58,25.65 54.1,24.13 66.04,24.13 67.31,22.86 IC2.13
X7
  Top 0.406: LED16.A 6.35,74.42 7.62,73.15 38.86,73.15 51.82,60.2 51.82,23.37 53.59,21.59 66.04,21.59 67.31,20.32 IC2.12
Y0
  Top 0.406: LED17.A 50.29,56.39 50.29,43.43 49.28,42.42 46.74,42.42 45.97,41.66 45.97,39.88 47.75,38.1 IC3.19
Y1
  Top 0.406: LED18.A 37.85,63.75 40.89,63.75 49.28,55.37 49.28,49.78 45.97,46.48 45.97,44.2 44.2,42.42 36.83,42.42 36.07,41.66 36.07,38.35 37.59,36.83 45.72,36.83 46.99,35.56 IC3.18
Y2
  Top 0.406: LED19.A 31.75,63.25 32,62.99 40.64,62.99 48.51,55.12 48.51,50.04 45.21,46.74 45.21,44.45 43.94,43.18 36.32,43.18 35.31,42.16 35.31,35.56 36.58,34.29 45.72,34.29 46.99,33.02 IC3.17
Y3
  Top 0.406: LED20.A 26.67,62.48 26.92,62.23 40.13,62.23 47.75,54.61 47.75,50.29 43.94,46.48 40.39,46.48 38.1,44.2 36.32,44.2 34.54,42.42 34.54,33.02 35.81,31.75 45.72,31.75 46.99,30.48 IC3.16
Y4
  Top 0.406: LED21.A 21.59,61.72 21.84,61.47 39.88,61.47 46.74,54.61 46.99,54.36 46.99,50.55 43.69,47.24 40.13,47.24 37.85,44.96 36.07,44.96 33.78,42.67 33.78,30.23 34.8,29.21 45.72,29.21 46.99,27.94 IC3.15
Y5
  Top 0.406: LED22.A 16.51,61.47 17.27,60.71 39.62,60.71 46.23,54.1 46.23,50.8 43.43,48.01 39.88,48.01 37.59,45.72 35.81,45.72 33.02,42.93 33.02,27.69 34.04,26.67 45.72,26.67 46.99,25.4 IC3.14
Y6
  Top 0.406: LED23.A 11.43,60.45 11.94,59.94 39.37,59.94 45.47,53.85 45.47,51.05 43.18,48.77 39.62,48.77 37.34,46.48 35.31,46.48 32.26,43.43 32.26,24.89 33.02,24.13 45.72,24.13 46.99,22.86 IC3.13
Y7
  Top 0.406: LED24.A 6.35,60.2 7.37,59.18 39.12,59.18 44.7,53.59 44.7,51.31 42.93,49.53 39.37,49.53 37.08,47.24 34.8,47.24 31.5,43.94 31.5,22.61 32.51,21.59 45.72,21.59 46.99,20.32 IC3.12
Z
  Bottom 0.406: LED50.A 68.58,72.9 69.09,73.41 78.74,73.41 79.25,73.91 79.25,81.79 78.74,82.3 71.88,82.3 71.12,83.06 IC5.17
(copper drawn outside any net)
  shapes: Bottom circle x4